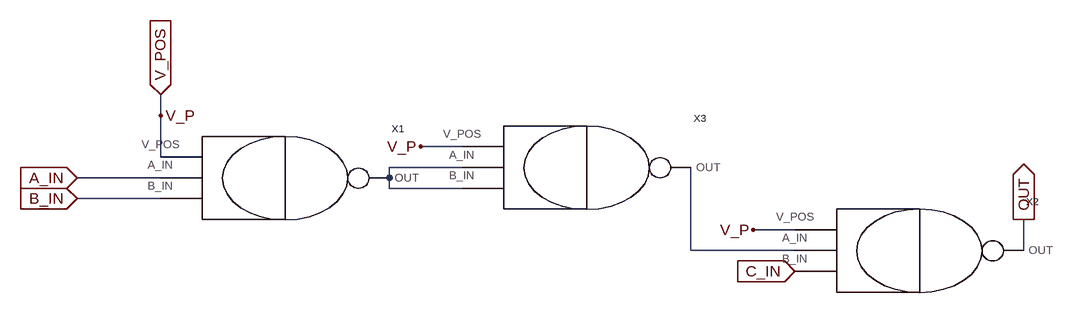
[diagram p0: schematic nand3.asc]
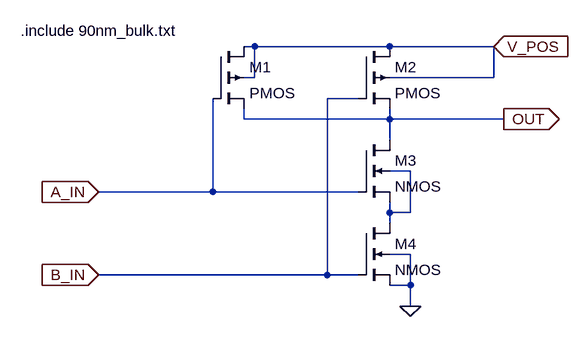
[diagram p1: sub-circuit nand.asc]
nand3.asc, the LTspice schematic file:
Version 4
SHEET 1 1272 680
WIRE -160 96 -160 64
WIRE 304 144 240 144
WIRE -160 160 -160 96
WIRE 304 176 192 176
WIRE -160 192 -288 192
WIRE 192 192 192 176
WIRE 192 208 192 192
WIRE 304 208 192 208
WIRE -160 224 -288 224
WIRE 816 272 752 272
WIRE 656 304 656 176
WIRE 816 304 656 304
WIRE 1168 304 1168 256
FLAG -160 64 V_POS
IOPIN -160 64 In
FLAG -288 192 A_IN
IOPIN -288 192 In
FLAG -288 224 B_IN
IOPIN -288 224 In
FLAG 816 336 C_IN
IOPIN 816 336 In
FLAG 1168 256 OUT
IOPIN 1168 256 Out
FLAG -160 96 V_P
FLAG 240 144 V_P
FLAG 752 272 V_P
SYMBOL nand -16 192 R0
SYMATTR InstName X1
SYMBOL nand 960 304 R0
SYMATTR InstName X2
SYMBOL nand 448 176 R0
SYMATTR InstName X3

nand.asc, the sub-circuit schematic file:
Version 4
SHEET 1 880 680
WIRE 96 48 80 48
WIRE 304 48 96 48
WIRE 464 48 304 48
WIRE 96 96 96 48
WIRE 96 96 80 96
WIRE 464 96 464 48
WIRE 464 96 304 96
WIRE 256 128 208 128
WIRE 80 160 80 144
WIRE 304 160 304 144
WIRE 304 160 80 160
WIRE 480 160 304 160
WIRE 304 192 304 160
WIRE 336 240 304 240
WIRE 32 272 32 128
WIRE 32 272 -144 272
WIRE 256 272 32 272
WIRE 304 304 304 288
WIRE 336 304 336 240
WIRE 336 304 304 304
WIRE 304 320 304 304
WIRE 336 368 304 368
WIRE 208 400 208 128
WIRE 208 400 -144 400
WIRE 256 400 208 400
WIRE 336 416 336 368
WIRE 336 416 304 416
WIRE 336 448 336 416
FLAG 464 48 V_POS
IOPIN 464 48 In
FLAG 480 160 OUT
IOPIN 480 160 Out
FLAG -144 272 A_IN
IOPIN -144 272 In
FLAG -144 400 B_IN
IOPIN -144 400 In
FLAG 336 448 0
SYMBOL pmos4 32 48 R0
SYMATTR InstName M1
SYMATTR Value2 l=90n w=400n
SYMBOL pmos4 256 48 R0
SYMATTR InstName M2
SYMATTR Value2 l=90n w=400n
SYMBOL nmos4 256 192 R0
SYMATTR InstName M3
SYMATTR Value2 l=90n w=200n
SYMBOL nmos4 256 320 R0
SYMATTR InstName M4
SYMATTR Value2 l=90n w=200n
TEXT -264 24 Left 2 !.include 90nm_bulk.txt

The netlist it stands for:
* nand3.asc
XX1 A_IN B_IN V_P N001 nand
XX2 N002 C_IN V_P OUT nand
XX3 N001 N001 V_P N002 nand

* block symbol definitions
.subckt nand A_IN B_IN V_POS OUT
M1 V_POS A_IN OUT V_POS PMOS l=90n w=400n
M2 V_POS B_IN OUT V_POS PMOS l=90n w=400n
M3 OUT A_IN N001 N001 NMOS l=90n w=200n
M4 N001 B_IN 0 0 NMOS l=90n w=200n
.include 90nm_bulk.txt
.ends nand

.model NMOS NMOS
.model PMOS PMOS
.lib standard.mos
.backanno
.end